# EAGLE design PCBCONVEYOR (EAGLE 9.6.2)

## Sheet 1 of 2
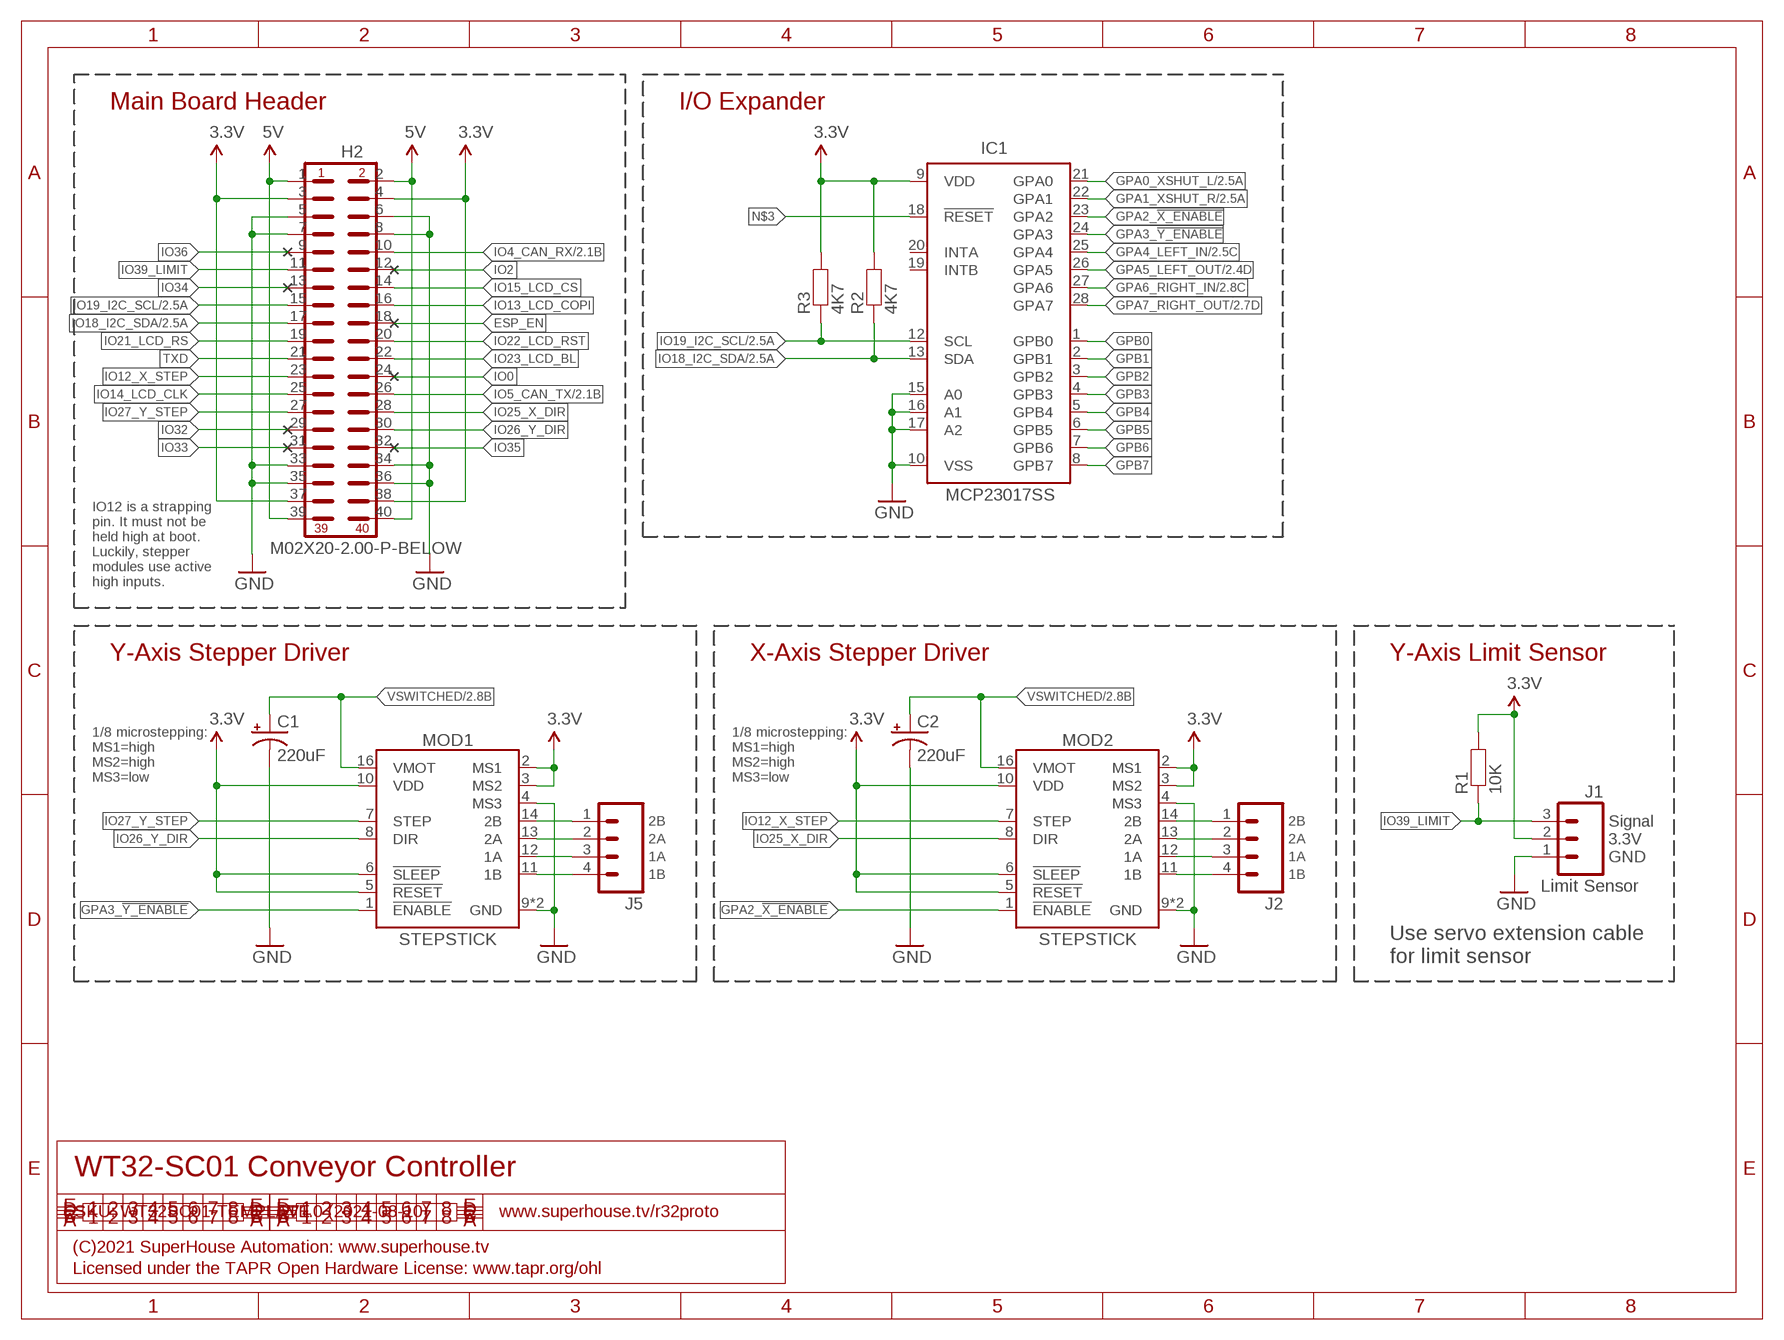
[diagram p0: schematic, sheet 1]

### Parts
C1  220uF  CAP_POLCPOL-RADIAL-220UF-50V  [CPOL-RADIAL-220UF-50V]
C2  220uF  CAP_POLCPOL-RADIAL-220UF-50V  [CPOL-RADIAL-220UF-50V]
H2  M02X20-2.00-P-BELOW  [2X20-2.00-P-BELOW]
IC1  MCP23017SS  [SSOP28]
J1  Limit Sensor  M03-PIN  [1X03-P]
J2  M04-SCREW-3.81MM-VERT-PLUG  [SCREWTERMINAL-3.81MM-VERT-4]
J5  M04-SCREW-3.81MM-VERT-PLUG  [SCREWTERMINAL-3.81MM-VERT-4]
MOD1  STEPSTICK  [STEPSTICK]
MOD2  STEPSTICK  [STEPSTICK]
R1  10K  RESISTOR0603  [R0603]
R2  4K7  RESISTOR0603  [R0603]
R3  4K7  RESISTOR0603  [R0603]

### Nets
3.3V: H2.3 H2.4 H2.37 H2.38 IC1.9(VDD) J1.2 MOD1.2(MS1) MOD1.3(MS2) MOD1.5(!RESET) MOD1.6(!SLEEP) MOD1.10(VDD) MOD2.2(MS1) MOD2.3(MS2) MOD2.5(!RESET) MOD2.6(!SLEEP) MOD2.10(VDD) R1.2 R2.2 R3.2 ; also sheet 2
5V: H2.1 H2.2 H2.39 H2.40 ; also sheet 2
ESP_EN: H2.18
GND: C1.2(-) C2.2(-) H2.5 H2.6 H2.7 H2.8 H2.33 H2.34 H2.35 H2.36 IC1.10(VSS) IC1.15(A0) IC1.16(A1) IC1.17(A2) J1.1 MOD1.4(MS3) MOD1.9(GND) MOD1.15(GND) MOD2.4(MS3) MOD2.9(GND) MOD2.15(GND) ; also sheet 2
GPA0_XSHUT_L: IC1.21(GPA0) ; also sheet 2
GPA1_XSHUT_R: IC1.22(GPA1) ; also sheet 2
GPA2_!X_ENABLE: IC1.23(GPA2) MOD2.1(!ENABLE)
GPA3_!Y_ENABLE: IC1.24(GPA3) MOD1.1(!ENABLE)
GPA4_LEFT_IN: IC1.25(GPA4) ; also sheet 2
GPA5_LEFT_OUT: IC1.26(GPA5) ; also sheet 2
GPA6_RIGHT_IN: IC1.27(GPA6) ; also sheet 2
GPA7_RIGHT_OUT: IC1.28(GPA7) ; also sheet 2
GPB0: IC1.1(GPB0)
GPB1: IC1.2(GPB1)
GPB2: IC1.3(GPB2)
GPB3: IC1.4(GPB3)
GPB4: IC1.5(GPB4)
GPB5: IC1.6(GPB5)
GPB6: IC1.7(GPB6)
GPB7: IC1.8(GPB7)
IO0: H2.24
IO2: H2.12
IO4_CAN_RX: H2.10 ; also sheet 2
IO5_CAN_TX: H2.26 ; also sheet 2
IO12_X_STEP: H2.23 MOD2.7(STEP)
IO13_LCD_COPI: H2.16
IO14_LCD_CLK: H2.25
IO15_LCD_CS: H2.14
IO18_I2C_SDA: H2.17 IC1.13(SDA) R2.1 ; also sheet 2
IO19_I2C_SCL: H2.15 IC1.12(SCL) R3.1 ; also sheet 2
IO21_LCD_RS: H2.19
IO22_LCD_RST: H2.20
IO23_LCD_BL: H2.22
IO25_X_DIR: H2.28 MOD2.8(DIR)
IO26_Y_DIR: H2.30 MOD1.8(DIR)
IO27_Y_STEP: H2.27 MOD1.7(STEP)
IO32: H2.29
IO33: H2.31
IO34: H2.13
IO35: H2.32
IO36: H2.9
IO39_LIMIT: H2.11 J1.3 R1.1
N$1: J2.1 MOD2.14(2B)
N$3: IC1.18(!RESET)
N$21: J2.2 MOD2.13(2A)
N$25: J5.1 MOD1.14(2B)
N$29: J5.2 MOD1.13(2A)
N$30: J5.3 MOD1.12(1A)
N$35: J5.4 MOD1.11(1B)
N$44: J2.3 MOD2.12(1A)
N$45: J2.4 MOD2.11(1B)
TXD: H2.21
VSWITCHED: C1.1(+) C2.1(+) MOD1.16(VMOT) MOD2.16(VMOT) ; also sheet 2
Unconnected: IC1.19(INTB) IC1.20(INTA)

### Notes on the sheet
- Main Board Header | I/O Expander
- IO12 is a strapping
  pin. It must not be
  held high at boot.
  Luckily, stepper
  modules use active
  high inputs.
- Y-Axis Stepper Driver | X-Axis Stepper Driver | Y-Axis Limit Sensor
- 1/8 microstepping:
  MS1=high
  MS2=high
  MS3=low
- 1/8 microstepping:
  MS1=high
  MS2=high
  MS3=low
- 2B | 2B | Signal
- 2A | 2A | 3.3V
- 1A | 1A | GND
- 1B | 1B
- Use servo extension cable
  for limit sensor
- WT32-SC01 Conveyor Controller
- SKU: WT32SC01-TEMPLATE | V1.0 (2021-08-10) | www.superhouse.tv/r32proto
- (C)2021 SuperHouse Automation: www.superhouse.tv
- Licensed under the TAPR Open Hardware License: www.tapr.org/ohl

## Sheet 2 of 2
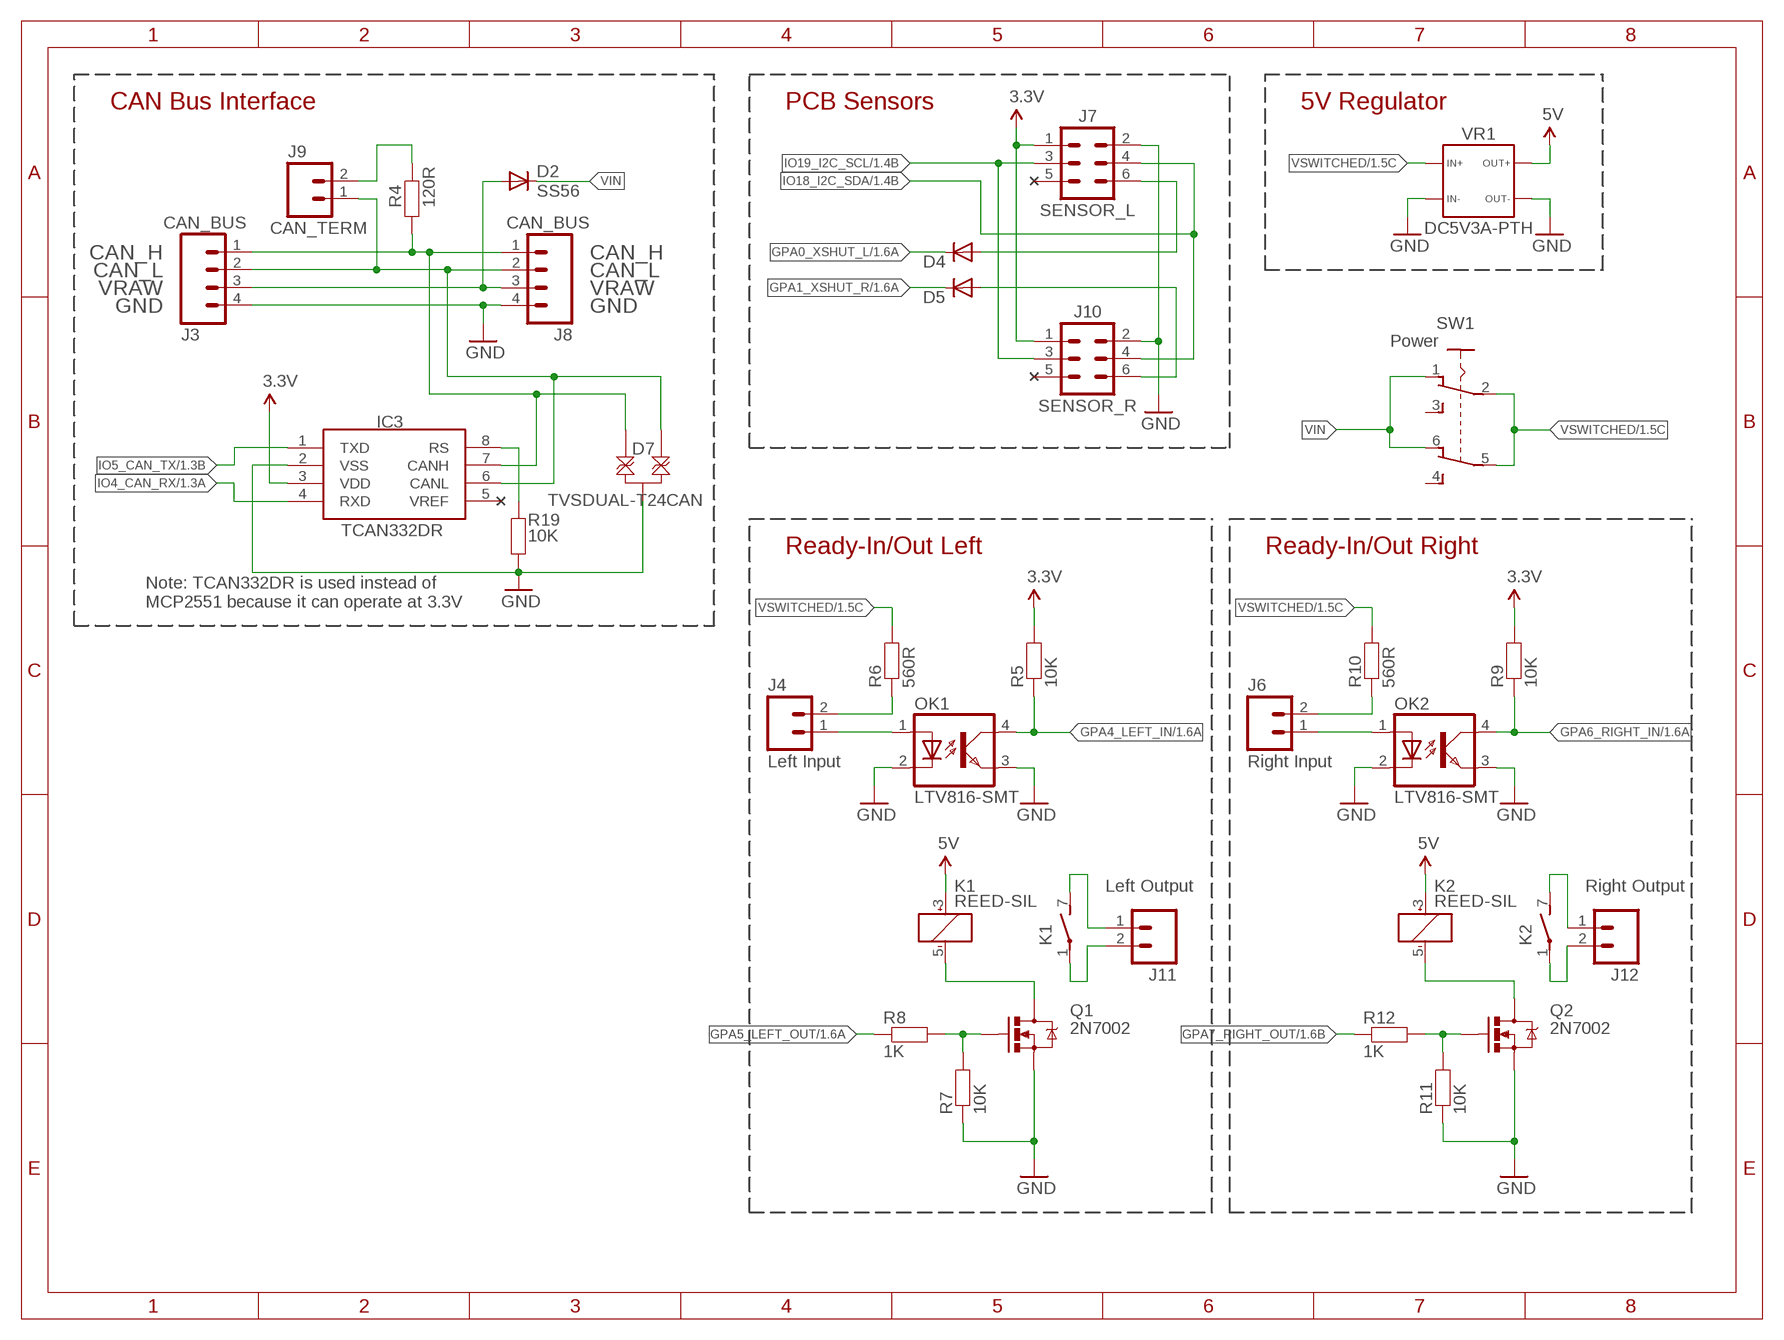
[diagram p1: schematic, sheet 2]

### Parts
D2  SS56  DIODESMA  [SMA-DIODE]
D4  DIODESOD  [SOD-323]
D5  DIODESOD  [SOD-323]
D7  TVSDUAL-T24CAN  [SOT23-3]
IC3  TCAN332DR  MCP2551  [SO08]
J3  CAN_BUS  M04-SCREW-3.81MM-VERT-PLUG  [SCREWTERMINAL-3.81MM-VERT-4]
J4  Left Input  M02-KF2510  [1X02-KF2510]
J6  Right Input  M02-KF2510  [1X02-KF2510]
J7  SENSOR_L  M02X3-SHROUDED  [2X3-2.54-SHROUDED]
J8  CAN_BUS  M04-SCREW-3.81MM-VERT-PLUG  [SCREWTERMINAL-3.81MM-VERT-4]
J9  CAN_TERM  M02-PIN-JUMP-Y  [1X02-P-JUMP-Y]
J10  SENSOR_R  M02X3-SHROUDED  [2X3-2.54-SHROUDED]
J11  Left Output  M02-KF2510  [1X02-KF2510]
J12  Right Output  M02-KF2510  [1X02-KF2510]
K1  REED-SIL  [REED]
K2  REED-SIL  [REED]
OK1  LTV816-SMT  [SMD4]
OK2  LTV816-SMT  [SMD4]
Q1  2N7002  MOSFET-NCHANNEL-233  [SOT23-3]
Q2  2N7002  MOSFET-NCHANNEL-233  [SOT23-3]
R4  120R  RESISTOR2010  [R2010]
R5  10K  RESISTOR0603  [R0603]
R6  560R  RESISTOR0603  [R0603]
R7  10K  RESISTOR0603  [R0603]
R8  1K  RESISTOR0603  [R0603]
R9  10K  RESISTOR0603  [R0603]
R10  560R  RESISTOR0603  [R0603]
R11  10K  RESISTOR0603  [R0603]
R12  1K  RESISTOR0603  [R0603]
R19  10K  RESISTOR0603  [R0603]
SW1  Power  SWITCH-DPDT3  [7201SD9AV2BE]
VR1  DC5V3A-PTH  [DC5V3A-PTH]

### Nets
3.3V: IC3.3(VDD) J7.1 J10.1 R5.2 R9.2 ; also sheet 1
5V: K1.3(1:+) K2.3(1:+) VR1.3A VR1.3B ; also sheet 1
CAN_H1: D7.2 IC3.7(CANH) J3.1 J8.1 R4.1
CAN_L1: D7.1 IC3.6(CANL) J3.2 J8.2 J9.1
CAN_VIN: D2.A J3.3 J8.3
GND: D7.3 IC3.2(VSS) J3.4 J7.2 J8.4 J10.2 OK1.2(C) OK1.3(EMIT) OK2.2(C) OK2.3(EMIT) Q1.2(S) Q2.2(S) R7.1 R11.1 R19.1 VR1.1A VR1.1B VR1.4A VR1.4B ; also sheet 1
GPA0_XSHUT_L: D4.1(C) ; also sheet 1
GPA1_XSHUT_R: D5.1(C) ; also sheet 1
GPA4_LEFT_IN: OK1.4(COL) R5.1 ; also sheet 1
GPA5_LEFT_OUT: R8.1 ; also sheet 1
GPA6_RIGHT_IN: OK2.4(COL) R9.1 ; also sheet 1
GPA7_RIGHT_OUT: R12.1 ; also sheet 1
IO4_CAN_RX: IC3.4(RXD) ; also sheet 1
IO5_CAN_TX: IC3.1(TXD) ; also sheet 1
IO18_I2C_SDA: J7.4 J10.4 ; also sheet 1
IO19_I2C_SCL: J7.3 J10.3 ; also sheet 1
N$2: IC3.8(RS) R19.2
N$20: J9.2 R4.2
N$22: D5.2(A) J10.6
N$24: J4.1 OK1.1(A)
N$26: J4.2 R6.1
N$27: D4.2(A) J7.6
N$28: K1.5(1:-) Q1.3(D)
N$31: J11.2 K1.1(2:P)
N$32: Q1.1(G) R7.2 R8.2
N$34: J11.1 K1.7(2:S)
N$36: Q2.1(G) R11.2 R12.2
N$38: K2.5(1:-) Q2.3(D)
N$40: J12.2 K2.1(2:P)
N$41: J12.1 K2.7(2:S)
N$42: J6.1 OK2.1(A)
N$43: J6.2 R10.1
VIN: D2.C SW1.1 SW1.6
VSWITCHED: R6.2 R10.2 SW1.2 SW1.5 VR1.2A VR1.2B ; also sheet 1
Unconnected: IC3.5(VREF) J7.5 J10.5 SW1.3 SW1.4

### Notes on the sheet
- CAN Bus Interface | PCB Sensors | 5V Regulator
- CAN_H | CAN_H
- CAN_L | CAN_L
- VRAW | VRAW
- GND | GND
- Ready-In/Out Left | Ready-In/Out Right
- Note: TCAN332DR is used instead of
  MCP2551 because it can operate at 3.3V

## Library data of the parts
C1 C2 = SuperHouse-Capacitors:CAP_POL: Capacitor Polarized These are standard SMD and PTH capacitors. Normally 10uF, 47uF, and 100uF in electrolytic and tantalum varieties. Always verify the external diameter of the through hole cap, it varies with capacity, voltage, and manufacturer. The EIA devices should be standard.
D2 D4 D5 = SuperHouse-Diodes:DIODE: Diode Standard reverse protection diodes and small signal diodes. SMA package can handle up to about 1A. SOD-323 can handle about 200mA.
D7 = SuperHouse-Diodes:TVSDUAL: Transient Voltage Suppressor (dual)
H2 = SuperHouse-Connectors:M02X20: M40 header in 2x20 format
IC1 = SuperHouse-ICs:MCP23017: http://ww1.microchip.com/downloads/en/DeviceDoc/21952a.pdf Source: http://ww1.microchip.com/downloads/en/DeviceDoc/21952a.pdf
IC3 = SuperHouse-ICs:MCP2551: CAN bus transceiver. Pin compatible chips with different specs include: MCP2551 (5V only) TCAN332DR (3.3V)
J1 = SuperHouse-Connectors:M03: 3-way header Standard 1x3 header, and screw terminal variations
J2 J3 J5 J8 = SuperHouse-Connectors:M04: 4-way header Standard 1x4 header, and screw terminal variations
J4 J6 J9 J11 J12 = SuperHouse-Connectors:M02: 2-way header Standard 1x2 header, and screw terminal variations
J7 J10 = SuperHouse-Connectors:M02X3: M6 header in 2x3 format
K1 K2 = SuperHouse-Relays:REED: RELAY reed, 1 x norm. open with polarity, grid 5.08
MOD1 MOD2 = SuperHouse-MotorDrivers:STEPSTICK
OK1 OK2 = SuperHouse-LEDs:LTV816: OPTO COUPLER Source: LITEON, LTV816.pdf; OC_FARNELL: unknown; OC_NEWARK: unknown
Q1 Q2 = SuperHouse-Transistors:MOSFET-NCHANNEL: N-channel MOSFET
R1-R12 R19 = SuperHouse-Resistors:RESISTOR: Resistors in both surface-mount and through-hole versions.
SW1 = SuperHouse-Switches:SWITCH-DPDT: DPDT toggle switch
VR1 = SuperHouse-Regulators:DC5V3A: 5V 3A voltage regulator module from AliExpress

## Board
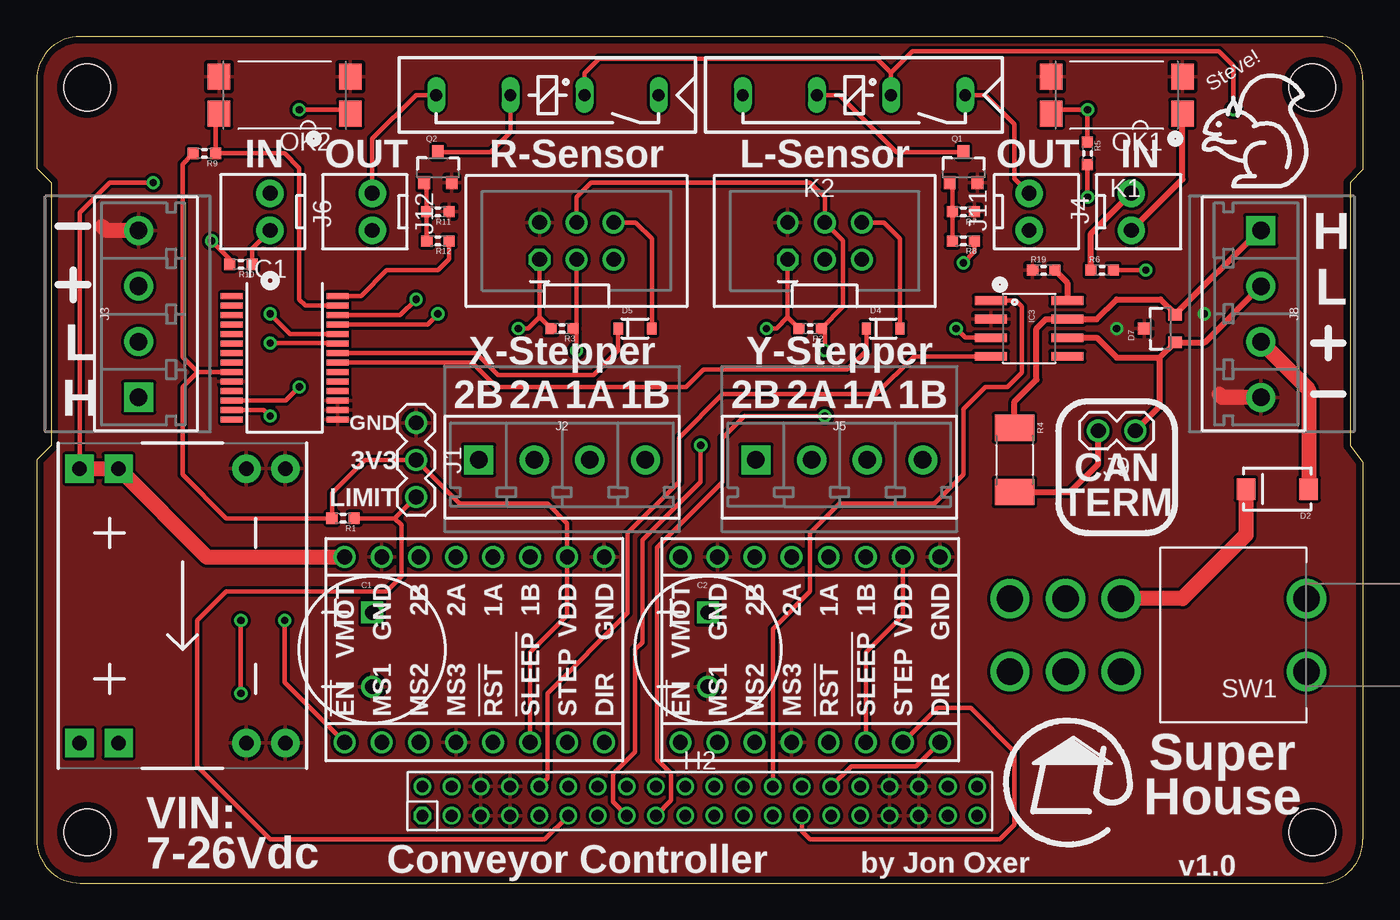
[diagram p2: board, top side]
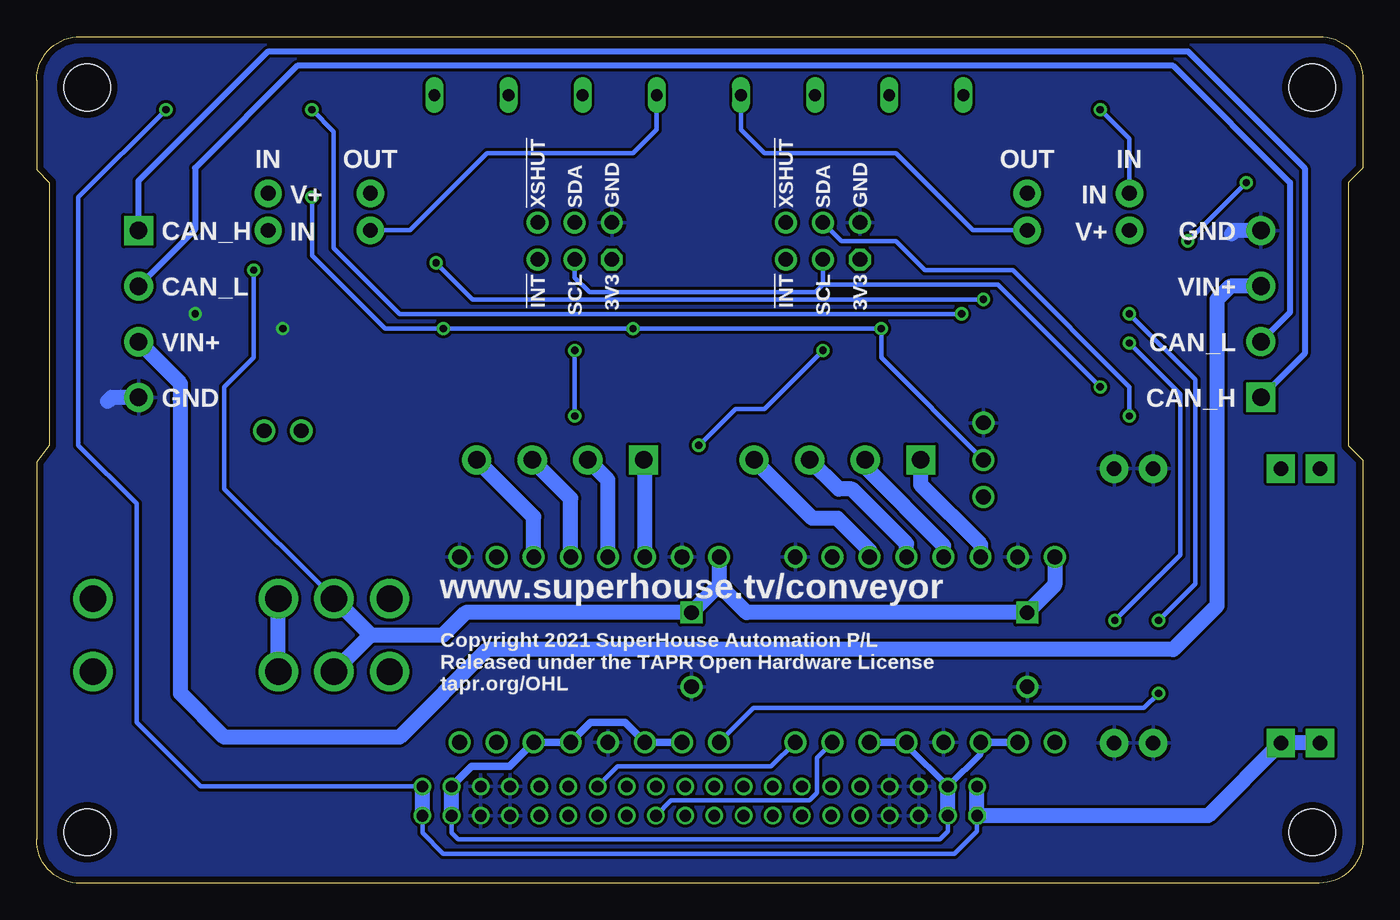
[diagram p3: board, bottom side, seen from below]

Size 90.87 x 58.01 mm. Coordinates in mm from the lower left corner, seen from the top.
Outline: 87.87,58.01 3,58.01 arc90 0,55.01 0,49 1,48 1,30 0,29 0,3 arc90 3,0 87.87,0 arc92 90.87,3 90.87,28.87 90,30 90,48 90.87,48.87 90.87,55.01 arc90 87.87,58.01
Copper layers (1*16): Top 0.035mm / dielectric 1.5mm / Bottom 0.035mm
Design rules "SuperHouse-Design-Rules *": minimum track width 10mil, minimum drill 24mil, track to track 8mil, track to pad 8mil, pad to pad 8mil, via to via 8mil, smd to smd 6mil, copper to edge 18mil, drill to drill 8mil, minimum pad ring 7mil, minimum via ring 8mil, stop-mask expansion 4mil, vias tented up to drill 0.5mm, thermal gap 10mil
Holes 3.2 mm at 3.47,54.52 3.47,3.49 87.4,54.52 87.4,3.49

### Footprints (pad centres in the part's own frame; a part is rotated, then mirrored left to right if it is on the bottom)
CPOL-RADIAL-220UF-50V = drill 1 square: 1 0,2.54 | drill 1: 2 0,-2.54
SMA-DIODE = smd 1.27 x 1.47: A -2.15,0; C 2.15,0
SOD-323 = smd 0.63 x 0.83: 1 -1.15,0; 2 1.15,0
SOT23-3 = smd 0.8 x 0.9: 1 -0.95,-1; 2 0.95,-1; 3 0,1.1
2X20-2.00-P-BELOW = drill 0.8 octagon: 1 -19,-1 | drill 0.8: 2 -19,1; 3 -17,-1; 4 -17,1; 5 -15,-1; 6 -15,1; 7 -13,-1; 8 -13,1; 9 -11,-1; 10 -11,1; 11 -9,-1; 12 -9,1; 13 -7,-1; 14 -7,1; 15 -5,-1; 16 -5,1; 17 -3,-1; 18 -3,1; 19 -1,-1; 20 -1,1; 21 1,-1; 22 1,1; 23 3,-1; 24 3,1; 25 5,-1; 26 5,1; 27 7,-1; 28 7,1; 29 9,-1; 30 9,1; 31 11,-1; 32 11,1; 33 13,-1; 34 13,1; 35 15,-1; 36 15,1; 37 17,-1; 38 17,1; 39 19,-1; 40 19,1
SSOP28 = smd 0.4 x 1.5: 1 -4.225,-3.625; 2 -3.575,-3.625; 3 -2.925,-3.625; 4 -2.275,-3.625; 5 -1.625,-3.625; 6 -0.975,-3.625; 7 -0.325,-3.625; 8 0.325,-3.625; 9 0.975,-3.625; 10 1.625,-3.625; 11 2.275,-3.625; 12 2.925,-3.625; 13 3.575,-3.625; 14 4.225,-3.625; 15 4.225,3.625; 16 3.575,3.625; 17 2.925,3.625; 18 2.275,3.625; 19 1.625,3.625; 20 0.975,3.625; 21 0.325,3.625; 22 -0.325,3.625; 23 -0.975,3.625; 24 -1.625,3.625; 25 -2.275,3.625; 26 -2.925,3.625; 27 -3.575,3.625; 28 -4.225,3.625
SO08 = smd 0.61 x 2.21: 1 -1.905,-2.616; 2 -0.635,-2.616; 3 0.635,-2.616; 4 1.905,-2.616; 5 1.905,2.616; 6 0.635,2.616; 7 -0.635,2.616; 8 -1.905,2.616
1X03-P = drill 1.016: 1 -2.54,0; 2 0,0; 3 2.54,0
SCREWTERMINAL-3.81MM-VERT-4 = drill 1.2 pad 2 square: 1 -5.715,0 | drill 1.2 pad 2: 2 -1.902,0; 3 1.908,0; 4 5.718,0
1X02-KF2510 = drill 1.016 pad 1.88: 1 -1.27,0; 2 1.27,0
2X3-2.54-SHROUDED = drill 1 octagon: 1 -2.54,-1.27 | drill 1: 2 -2.54,1.27; 3 0,-1.27; 4 0,1.27; 5 2.54,-1.27; 6 2.54,1.27
1X02-P-JUMP-Y = drill 1.016: 1 -1.27,0; 2 1.27,0
REED = drill 0.813 long: 1 -7.62,0; 3 -2.54,0; 5 2.54,0; 7 7.62,0
STEPSTICK = drill 1: 1 -6.35,8.89; 2 -6.35,6.35; 3 -6.35,3.81; 4 -6.35,1.27; 5 -6.35,-1.27; 6 -6.35,-3.81; 7 -6.35,-6.35; 8 -6.35,-8.89; 9 6.35,-8.89; 10 6.35,-6.35; 11 6.35,-3.81; 12 6.35,-1.27; 13 6.35,1.27; 14 6.35,3.81; 15 6.35,6.35; 16 6.35,8.89
SMD4 = smd 1.78 x 1.55: 1 -1.27,-4.5; 2 1.27,-4.5; 3 1.27,4.5; 4 -1.27,4.5
R0603 = smd 0.762 x 0.762: 1 -0.762,0; 2 0.762,0
R2010 = smd 1.8 x 2.7: 1 -2.2,0; 2 2.2,0
7201SD9AV2BE = drill 1.8: 1 12.7,-2.5; 2 16.51,-2.5; 3 20.32,-2.5; 4 20.32,2.5; 5 16.51,2.5; 6 12.7,2.5; 7 0,2.5; 8 0,-2.5
DC5V3A-PTH = drill 1 pad 1.93: 1A -9.4,7.05; 1B -9.4,4.375; 4A 9.4,7.05; 4B 9.4,4.375 | drill 1 pad 1.93 square: 2A -9.4,-4.375; 2B -9.4,-7.05; 3A 9.4,-4.375; 3B 9.4,-7.05

### Placement (x,y rotation side)
C1  23,16 0 top
C2  46,16 0 top
D2  85,27 180 top
D4  58,38 0 top
D5  41,38 0 top
D7  77,38 90 top
H2  45.44,5.62 0 top
IC1  17,36 270 top
IC3  68,38 270 top
J1  26,29 270 top
J2  36,29 0 top
J3  7,39 90 top
J4  75,46 90 top
J5  55,29 0 top
J6  16,46 270 top
J7  54,44 0 top
J8  83.87,39 270 top
J9  74,31 180 top
J10  37,44 0 top
J11  68,46 90 top
J12  23,46 270 top
K1  56,54 180 top
K2  35,54 180 top
MOD1  53,16 90 top
MOD2  30,16 90 top
OK1  74,54 90 top
OK2  17,54 90 top
Q1  63.5,49 0 top
Q2  27.5,49 0 top
R1  21,25 180 top
R2  53,38 180 top
R3  36,38 180 top
R4  67,29 270 top
R5  72,50 270 top
R6  73,42 0 top
R7  63.5,46 180 top
R8  63.5,44 180 top
R9  11.5,50 180 top
R10  14,42.4 180 top
R11  27.5,46 180 top
R12  27.5,44 180 top
R19  69,42 0 top
SW1  87,17 180 top
VR1  10,19 270 top

### Tracks (layer width: path | path; a pad name or v marks a point on that pad's centre or on a via)
3.3V  (via drill 0.5)
  Top 0.305: 11.03,35.02 10,34 10,28 13,25 R1.2 20.24,26.74 22.5,29 J1.2 29,26 35,26 36.35,24.65 MOD2.10 36.35,18.35 33.81,15.81 MOD2.6 | 11.03,35.02 IC1.9 | 11.03,35.02 10,36.05 10,49.26 R9.2 | 34.46,38.78 J10.1 | 51.46,38.78 J7.1 | IC3.3 63.63,37.37 v63,38 | v50,38 50.68,38 51.46,38.78 | v33,38 33.68,38 34.46,38.78 | MOD1.10 59.35,18.35 56.81,15.81 MOD1.6 | R5.2 v72,47 | R3.2 34.46,38.78 | R2.2 51.46,38.78
  Bottom 0.305: H2.3 28.43,3.56 29,3 62,3 62.44,3.44 H2.37 | v72,47 72,43 67,38 v63,38 v50,38 v33,38 33,36 J1.2
  Bottom 0.406: MOD2.3 26.19,8.87 H2.4 31.27,9.46 MOD2.5
  Bottom 0.508: MOD2.2 MOD2.3 | MOD2.5 MOD2.6 | MOD1.2 MOD1.3 50.54,11 52.92,11 MOD1.5 MOD1.6 58.46,8 61.05,8 H2.38
  Bottom 1.016: H2.3 H2.4 | H2.37 H2.38
5V  (via drill 0.5)
  Top 0.305: K2.3 37.54,55.5 38.54,56.5 57.58,56.5 58.54,55.54 | K1.3 58.54,55.54 | 58.54,55.54 60,57 81,57 82,56 v82,53
  Bottom 0.305: H2.39 64.44,3.44 63,2 28,2 26.43,3.56 H2.1 | H2.40 79.62,6.62 84,11 84,26 88,30 88,47 v82,53
  Bottom 1.016: H2.39 H2.40 | H2.2 H2.1 10.61,4.62 VR1.3A VR1.3B
CAN_H1
  Top 0.406: D7.2 78.03,38.98 | 78.03,38.98 83.77,44.72 J8.1 | 78.03,38.98 77,40 74,40 72.64,38.63 IC3.7 69.14,38.63 68.5,38 68.5,34.5 67,33 R4.1
  Bottom 0.406: J8.1 83.87,48.13 75,57 12,57 4,49 4,36.28 J3.1
CAN_L1
  Top 0.406: J8.2 80.02,37.05 D7.1 76.95,36 | IC3.6 72.64,37.37 74,36 76.95,36 | J9.1 76.95,32.68 76.95,36
  Bottom 0.406: J3.2 5,39.1 5,48 13,56 73,56 80,49 80,44.77 J8.2
CAN_VIN
  Top 1.016: D2.A 87.15,33.81 J8.3
  Bottom 1.016: J3.3 9.09,40.91 10,40 10,19 13,16 60,16 66,10 78,10 81,13 81,34.22 J8.3
GND  (via drill 0.5)
  Top 1.016: J3.4 4.78,44.72 4.5,45 | J8.4 81.22,33.28 81,33.5
  Bottom 1.016: J3.4 8.78,44.72 9,44.5 | J8.4 85.72,33.28 86,33
  other vias: 74,38 80,39
  pour Bottom: 90.87,3 arc-90 87.87,0 3,0 arc-90 0,3 0,29 1,30 1,48 0,49 0,55.01 arc-90 3,58.01 87.87,58.01 arc-90 90.87,55.01 90.87,48.87 90,48 90,30 90.87,28.87
  pour Top: 87.87,0 3,0 arc-90 0,3 0,29 1,30 1,48 0,49 0,55.01 arc-90 3,58.01 87.87,58.01 arc-90 90.87,55.01 90.87,48.87 90,48 90,30 90.87,28.87 90.87,3 arc-90
GPA0_XSHUT_L
  Top 0.305: D4.1 56.85,36.5 55.52,35.17 45.67,35.17 44.5,34 31.5,34 29.82,35.67 IC1.21
GPA1_XSHUT_R
  Top 0.305: D5.1 39.85,36.5 38.17,34.83 31.62,34.83 30.12,36.33 IC1.22
GPA2_!X_ENABLE  (via drill 0.5)
  Top 0.305: MOD2.1 17,13.76 v17,18 | v16,37 20.6,37 IC1.23
  Bottom 0.305: v17,18 12.5,22.5 12.5,33.5 v16,37
GPA3_!Y_ENABLE  (via drill 0.5)
  Top 0.305: v14,13 v14,18 | v16,39 17.38,37.62 IC1.24
  Bottom 0.305: MOD1.1 41.76,12 15,12 v14,13 | v14,18 11.5,20.5 11.5,34.5 v16,39
GPA4_LEFT_IN  (via drill 0.5)
  Top 0.305: R5.1 v72,53 69.77,53 OK1.4 | IC1.25 26.77,38.27 v27.5,39
  Bottom 0.305: v72,53 70.5,51.5 70.5,43.5 66,39 v27.5,39
GPA5_LEFT_OUT  (via drill 0.5)
  Top 0.305: IC1.26 24.93,38.92 v26,40 | v63.5,42.5 64.26,43.26 R8.1
  Bottom 0.305: v26,40 37.28,40 37.29,39.99 60.99,39.99 v63.5,42.5
GPA6_RIGHT_IN
  Top 0.305: IC1.27 18.43,39.58 18,40 18,49 17,50 R9.1 12.26,52.49 OK2.4
GPA7_RIGHT_OUT
  Top 0.305: IC1.28 22.23,40.23 24,42 27.5,42 28.26,42.76 R12.1
IO4_CAN_RX
  Top 0.305: H2.10 35,7.18 35,13 40.5,18.5 40.5,24 44,27.5 44,30.5 47,33.5 57.5,33.5 60.09,36.09 IC3.4
IO5_CAN_TX
  Top 0.305: H2.26 50.44,17.43 53,20 53,24 55,26 61.5,26 63.5,28 63.5,32.5 65,34 66.5,34 67.5,35 67.5,39.5 67.09,39.91 IC3.1
IO12_X_STEP
  Bottom 0.305: H2.23 47.39,5.66 37.94,5.66 37.4,6.2 37.4,8.6 MOD2.7
IO18_I2C_SDA  (via drill 0.5)
  Top 0.305: J10.4 37,47 38,48 53,48 54,47 J7.4 55.25,44.02 55.25,39.49 R2.1 54,37.76 v54,36.5 | IC1.13 15.57,32.42 v16,32 | H2.17 43.48,5.66 43.48,7.52 42.5,8.5 42.5,23 47,27.5 47,30.5 48.5,32 v54,32
  Bottom 0.305: v16,32 16,34 24,42 30,42 32,44 35.73,44 J10.4 | v54,32 v54,36.5
IO19_I2C_SCL  (via drill 0.5)
  Top 0.305: IC1.12 17.07,33.08 v18,34 | J10.3 37,38.24 R3.1 37,37.76 v37,36.5 | H2.15 39.48,5.58 39.48,7.48 41,9 41,16 41.5,16.5 41.5,23.5 45.5,27.5 v45.5,30
  Bottom 0.305: J10.3 37,41 | 37,41 37.5,40.5 53,40.5 54,41.5 J7.3 | v18,34 25,41 37,41 | v45.5,30 43,32.5 41,32.5 v37,36.5
IO25_X_DIR
  Bottom 0.305: H2.28 51.05,8 40.54,8 MOD2.8
IO26_Y_DIR
  Top 0.305: H2.30 55.81,8 60.24,8 MOD1.8
IO27_Y_STEP
  Top 0.305: H2.27 52.44,3.56 53,3 66,3 67,4 67,9 64,12 61.7,12 MOD1.7
IO39_LIMIT
  Top 0.305: R1.1 24.54,25 | 24.54,25 J1.3 | H2.11 34.81,3 16,3 11,8 11,18 13,20 24,20 25,21 25,24.54 24.54,25
N$1
  Bottom 1.016: MOD2.14 26.19,23.19 30.29,27.29 J2.1
N$2
  Top 0.406: R19.2 70.62,41.15 IC3.8
N$20
  Top 0.406: R4.2 70.8,26.8 72.73,28.73 J9.2
N$21
  Bottom 1.016: MOD2.13 28.73,23.13 34.1,28.5 J2.2
N$22
  Top 0.305: D5.2 42.15,44.16 41.04,45.27 J10.6
N$24
  Top 0.406: J4.1 78.5,48.23 OK1.1
N$25
  Bottom 1.016: MOD1.14 49.19,28.91 J5.1
N$26
  Top 0.406: R6.1 72.24,44.51 J4.2
N$27
  Top 0.305: D4.2 59.15,44.16 58.04,45.27 J7.6
N$28
  Top 0.305: Q1.3 58.9,50.1 55,54 K1.5
N$29
  Bottom 1.016: MOD1.13 51.73,27.63 J5.2
N$30
  Bottom 1.016: MOD1.12 54.27,26.36 J5.3
N$31
  Top 0.305: J11.2 67,48.27 67,52 65,54 K1.1
N$32
  Top 0.305: R8.2 R7.2 62.74,47.81 Q1.1
N$34
  Bottom 0.305: J11.1 65.27,44.73 60,50 50,50 48.38,51.62 K1.7
N$35
  Bottom 1.016: MOD1.11 56.81,25.09 J5.4
N$36
  Top 0.305: R12.2 R11.2 26.74,47.81 Q2.1
N$38
  Top 0.305: Q2.3 31.1,50.1 32.46,51.46 K2.5
N$40
  Bottom 0.305: J12.2 26.73,44.73 32,50 41,50 42.62,51.62 K2.1
N$41
  Top 0.305: J12.1 23,51 26,54 K2.7
N$42  (via drill 0.5)
  Top 0.305: v18,53 21.23,53 OK2.1
  Bottom 0.305: J6.1 16,51 v18,53
N$43
  Top 0.305: R10.1 14.76,43.49 J6.2
N$44
  Bottom 1.016: MOD2.12 31.27,23.27 35,27 35.91,27 J2.3
N$45
  Bottom 1.016: MOD2.11 33.81,22.81 36,25 37.72,25 J2.4
VIN
  Top 1.016: D2.C 82.85,23.85 78.5,19.5 SW1.1
  Bottom 1.016: SW1.6 SW1.1
VSWITCHED  (via drill 0.5)
  Top 0.305: R6.2 v76,42 | v8,48 5,48 2.95,45.95 VR1.2B | R10.2 13.24,42.76 v12,44
  Top 1.016: VR1.2B VR1.2A 11.68,22.35 MOD2.16
  Bottom 0.305: v76,42 76,36 78,34 78,27.01 SW1.2 | v12,44 v8,48
  Bottom 1.016: MOD2.16 21.11,20.43 C1.1 42.22,18.54 44.11,20.43 | MOD1.16 44.11,20.43 | 44.11,20.43 C2.1 61.46,18.54 63,17 67.99,17 | SW1.5 67.99,17 | SW1.2 67.99,17

### Text on the board
tPlace: Steve! | IN | OUT | R-Sensor | L-Sensor | OUT | IN | H | L | L | X-Stepper | Y-Stepper | 2B | 2A | 1A | 1B | 2B | 2A | 1A | 1B | H | GND | 3V3 | CAN / TERM | LIMIT | Super / House | VIN: / 7-26Vdc | Conveyor Controller | by Jon Oxer | v1.0
bPlace: IN | OUT | OUT | IN | IN | V+ | GND | SDA | !XSHUT | GND | SDA | !XSHUT | GND | V+ | IN | CAN_H | 3V3 | SCL | !INT | 3V3 | SCL | !INT | VIN+ | CAN_L | CAN_L | VIN+ | CAN_H | GND | www.superhouse.tv/conveyor | Copyright 2021 SuperHouse Automation P/L / Released under the TAPR Open Hardware License / tapr.org/OHL